# EAGLE design trunetclock_v4 (EAGLE 5.10)
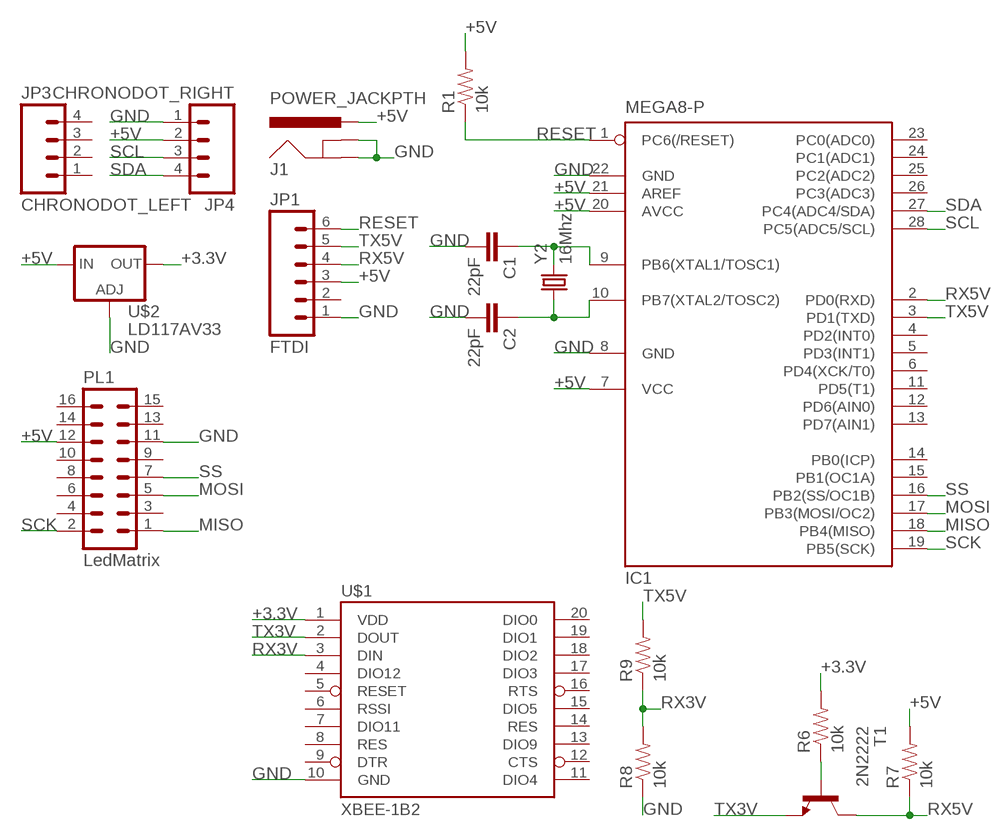
[diagram p0: schematic, sheet 1]

## Parts
C1  22pF  CAPPTH  [CAP-PTH-SMALL]
C2  22pF  CAPPTH  [CAP-PTH-SMALL]
IC1  MEGA8-P  [DIL28-3]
J1  POWER_JACKPTH  [POWER_JACK_PTH]
JP1  FTDI  M06SIP  [1X06]
JP3  CHRONODOT_LEFT  M04PTH  [1X04]
JP4  CHRONODOT_RIGHT  M04PTH  [1X04]
PL1  LedMatrix  16H  [16H]
R1  10k  RESISTORPTH-1/4W  [AXIAL-0.4]
R6  10k  RESISTORPTH-1/4W  [AXIAL-0.4]
R7  10k  RESISTORPTH-1/4W  [AXIAL-0.4]
R8  10k  RESISTORPTH-1/4W  [AXIAL-0.4]
R9  10k  RESISTORPTH-1/4W  [AXIAL-0.4]
T1  2N2222  [TO92-EBC-OVAL]
U$1  XBEE-1B2  [XBEE-SILK]
U$2  LD117AV33  [TO220L1]
Y2  16Mhz  CRYSTALHC49US  [HC49US]

## Nets
+3.3V: R6.P$2 U$1.1(VDD) U$2.2(OUT)
+5V: IC1.7(VCC) IC1.20(AVCC) IC1.21(AREF) J1.PWR JP1.3 JP4.2 PL1.12 R1.P$2 R7.P$2 U$2.3(IN)
GND: C1.2 C2.2 IC1.8(GND) IC1.22(GND) J1.GND J1.GNDBREAK JP1.1 JP4.1 PL1.11 R8.P$1 U$1.10(GND) U$2.1(ADJ)
MISO: IC1.18(PB4(MISO)) PL1.1
MOSI: IC1.17(PB3(MOSI/OC2)) PL1.5
N$4: C2.1 IC1.10(PB7(XTAL2/TOSC2)) Y2.1
N$5: C1.1 IC1.9(PB6(XTAL1/TOSC1)) Y2.2
N$8: R6.P$1 T1.B
RESET: IC1.1(PC6(/RESET)) JP1.6 R1.P$1
RX3V: R8.P$2 R9.P$1 U$1.3(DIN)
RX5V: IC1.2(PD0(RXD)) JP1.4 R7.P$1 T1.C
SCK: IC1.19(PB5(SCK)) PL1.2
SCL: IC1.28(PC5(ADC5/SCL)) JP4.3
SDA: IC1.27(PC4(ADC4/SDA)) JP4.4
SS: IC1.16(PB2(SS/OC1B)) PL1.7
TX3V: T1.E U$1.2(DOUT)
TX5V: IC1.3(PD1(TXD)) JP1.5 R9.P$2
Unconnected: IC1.4(PD2(INT0)) IC1.5(PD3(INT1)) IC1.6(PD4(XCK/T0)) IC1.11(PD5(T1)) IC1.12(PD6(AIN0)) IC1.13(PD7(AIN1)) IC1.14(PB0(ICP)) IC1.15(PB1(OC1A)) IC1.23(PC0(ADC0)) IC1.24(PC1(ADC1)) IC1.25(PC2(ADC2)) IC1.26(PC3(ADC3)) JP1.2 JP3.1 JP3.2 JP3.3 JP3.4 PL1.3 PL1.4 PL1.6 PL1.8 PL1.9 PL1.10 PL1.13 PL1.14 PL1.15 PL1.16 U$1.4(DIO12) U$1.5(RESET) U$1.6(RSSI) U$1.7(DIO11) U$1.8(RES) U$1.9(DTR) U$1.11(DIO4) U$1.12(CTS) U$1.13(DIO9) U$1.14(RES) U$1.15(DIO5) U$1.16(RTS) U$1.17(DIO3) U$1.18(DIO2) U$1.19(DIO1) U$1.20(DIO0)

## Library data of the parts
C1 C2 = SparkFun:CAP: Capacitor Standard 0603 ceramic capacitor, and 0.1" leaded capacitor.
IC1 = atmel:MEGA8-P: MICROCONTROLLER 8 Kbytes FLASH, 1 kbytes SRAM, 512 bytes EEPROM, USART, 4-channel 10 bit ADC, 2-channel 8 bit ADC Pin compatible with Atmega48, ATMega88, ATMega168 Source: avr.lbr; OC_FARNELL: unknown; OC_NEWARK: unknown
J1 = SparkFun:POWER_JACK: Power Jack This is the standard 5.5mm barrel jack for power. The PTH is the most common, proven, reliable, footprint. All others are experimental. The Slot footprint only works if the mill layer is transmitted to the PCB fab house so be warned. Spark Fun Electronics SKU : PRT-00119. Mating wall wart : TOL-00298 (and others)
JP1 = SparkFun:M06: Header 6 Standard 6-pin 0.1" header. Use with straight break away headers (SKU : PRT-00116), right angle break away headers (PRT-00553), swiss pins (PRT-00743), machine pins (PRT-00117), and female headers (PRT-00115). Molex polarized connector foot print use with SKU : PRT-08094 with associated crimp pins and housings. NOTES ON THE VARIANTS LOCK and LOCK_LONGPADS... This footprint was designed to help hold the alignment of a through-hole component (i.e. 6-pin header) while soldering it into place. You may notice that each hole has been shifted either up or down by 0.005 of an inch from it's more standard position (which is a perfectly straight line). This slight alteration caused the pins (the squares in the middle) to touch the edges of the holes. Because they are alternating, it causes a "brace" to hold the component in place. 0.005 has proven to be the perfect amount of "off-center" position when using our standard breakaway headers. Although looks a little odd when you look at the bare footprint, once you have a header in there, the alteration is very hard to notice. Also, if you push a header all the way into place, it is covered up entirely on the bottom side. This idea of altering the position of holes to aid alignment will be further integrated into the Sparkfun Library for other footprints. It can help hold any component with 3 or more connection pins.
JP3 JP4 = SparkFun:M04: Header 4 Standard 4-pin 0.1" header. Use with straight break away headers (SKU : PRT-00116), right angle break away headers (PRT-00553), swiss pins (PRT-00743), machine pins (PRT-00117), and female headers (PRT-00115). Molex polarized connector foot print use with SKU : PRT-08231 with associated crimp pins and housings.
PL1 = con-harting-h:16H: CONNECTOR; OC_FARNELL: unknown; OC_NEWARK: unknown
R1 R6-R9 = SparkFun:RESISTOR: Resistor Basic schematic elements and footprints for 0603, 1206, and PTH resistors.
T1 = adafruit:2N2222: NPN TRANSISTOR Big oval pads
U$1 = SparkFun:XBEE-1
U$2 = v-reg:LD117A?*: Low drop fixed and adjustable positive voltage regulators 1 A Source: http://www.st.com/stonline/products/literature/ds/7194/ld1117axx.pdf
Y2 = SparkFun:CRYSTAL: Crystals Various standard crystals. Proven footprints. Spark Fun Electronics SKU : COM-00534

## Board
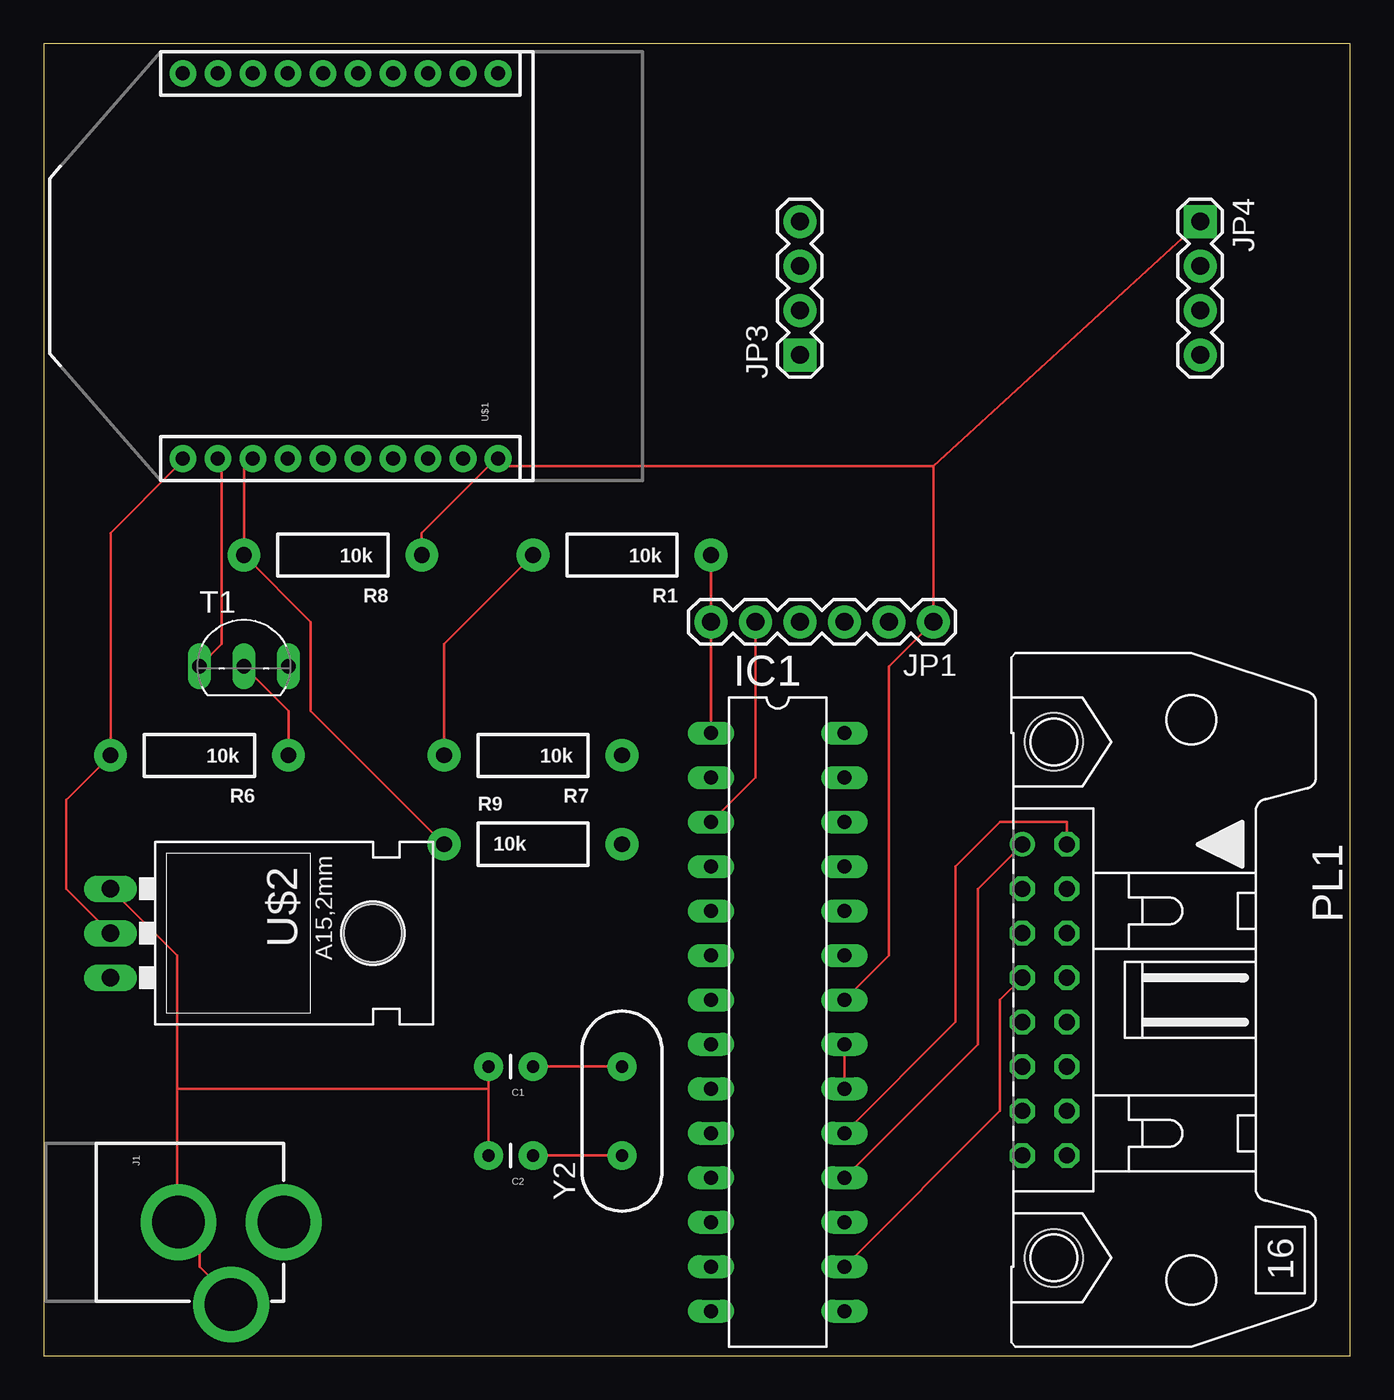
[diagram p1: board, top side]
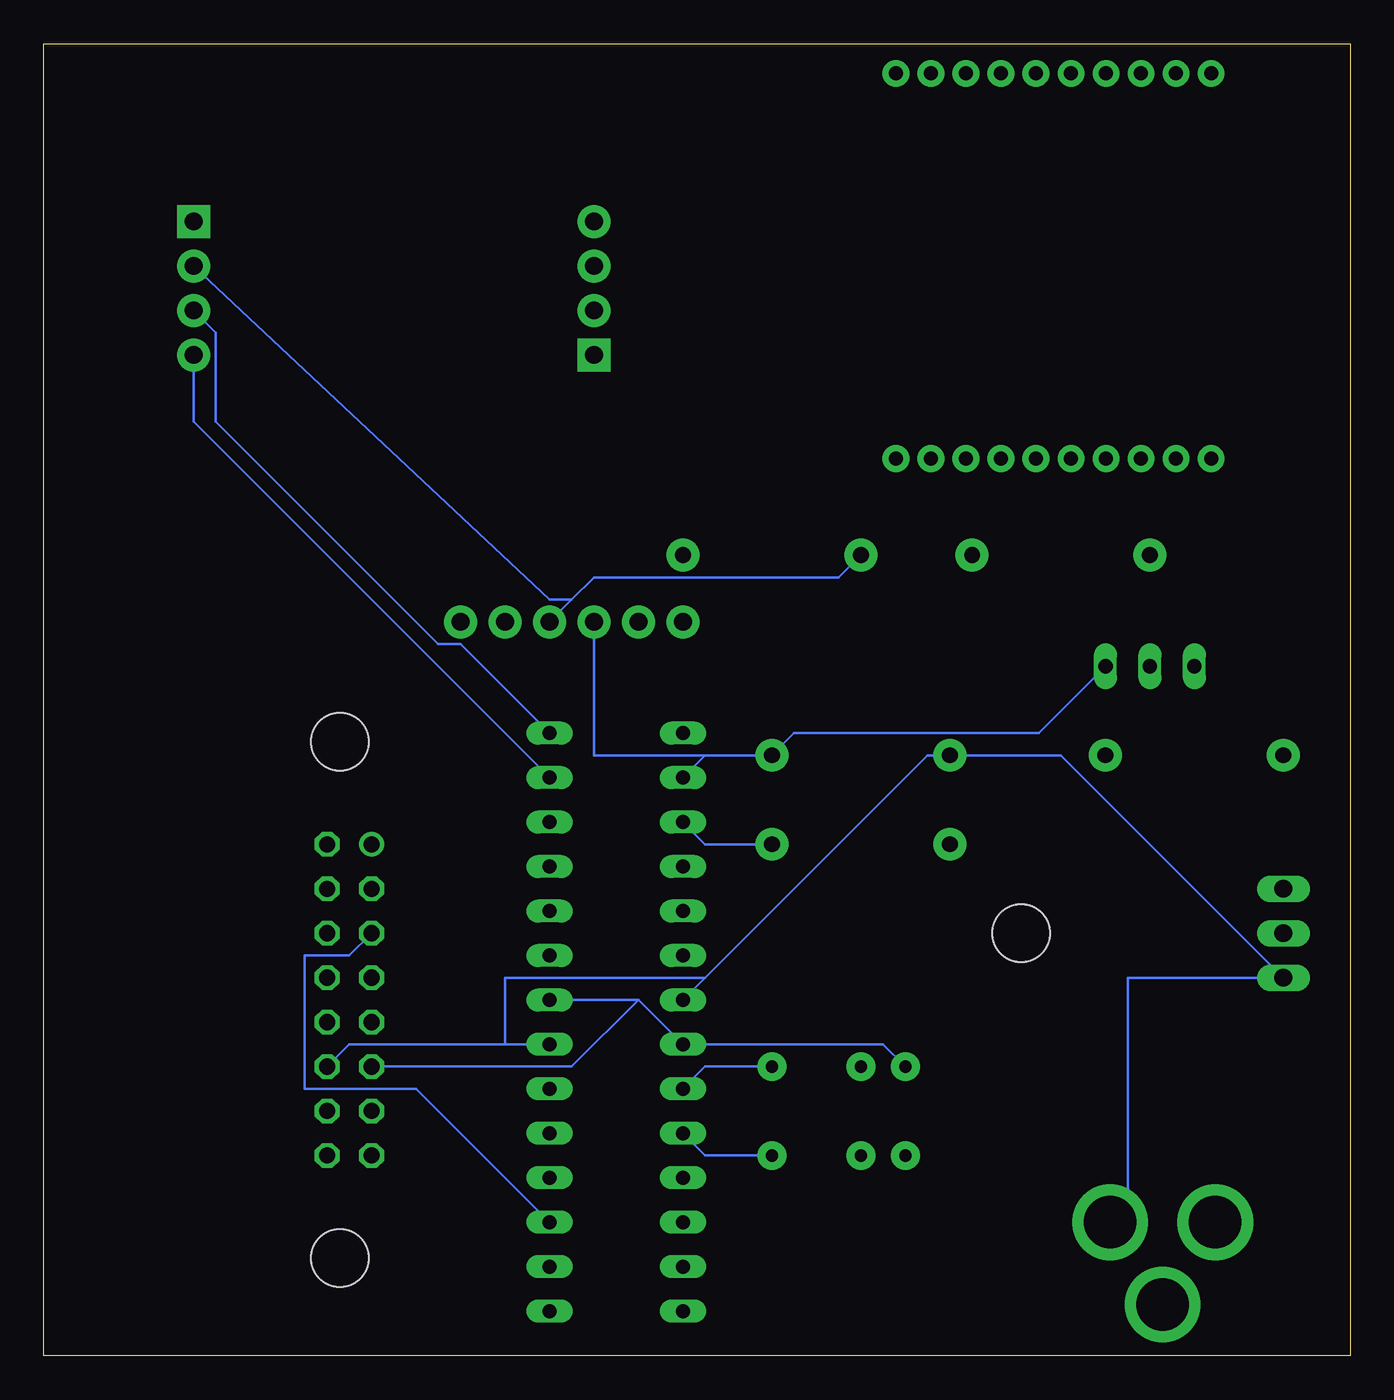
[diagram p2: board, bottom side, seen from below]

Size 74.6 x 74.92 mm. Coordinates in mm from the lower left corner, seen from the top.
Outline: 0,0 74.6,0 74.6,74.92 0,74.92 0,0
Copper layers (1*16): Top 0.035mm / dielectric 1.5mm / Bottom 0.035mm
Design rules "ITead_rule": minimum track width 6mil, minimum drill 12mil, track to track 6mil, track to pad 6mil, pad to pad 6mil, via to via 6mil, smd to smd 0mil, copper to edge 10mil, drill to drill 10mil, minimum pad ring 10mil, minimum via ring 6mil, stop-mask expansion 2mil, vias tented up to drill 100mil, thermal gap 10mil

### Footprints (pad centres in the part's own frame; a part is rotated, then mirrored left to right if it is on the bottom)
CAP-PTH-SMALL = drill 0.7 pad 1.651 round: 1 0,0; 2 2.54,0
DIL28-3 = drill 0.813 long: 1 -16.51,-3.81; 2 -13.97,-3.81; 3 -11.43,-3.81; 4 -8.89,-3.81; 5 -6.35,-3.81; 6 -3.81,-3.81; 7 -1.27,-3.81; 8 1.27,-3.81; 9 3.81,-3.81; 10 6.35,-3.81; 11 8.89,-3.81; 12 11.43,-3.81; 13 13.97,-3.81; 14 16.51,-3.81; 15 16.51,3.81; 16 13.97,3.81; 17 11.43,3.81; 18 8.89,3.81; 19 6.35,3.81; 20 3.81,3.81; 21 1.27,3.81; 22 -1.27,3.81; 23 -3.81,3.81; 24 -6.35,3.81; 25 -8.89,3.81; 26 -11.43,3.81; 27 -13.97,3.81; 28 -16.51,3.81
POWER_JACK_PTH = drill 2.997 pad 4.318 round: GND 0,7.7; GNDBREAK 4.7,10.7; PWR 0,13.7
1X06 = drill 1.016 pad 1.88 round: 1 0,0; 2 2.54,0; 3 5.08,0; 4 7.62,0; 5 10.16,0; 6 12.7,0
1X04 = drill 1.016 pad 1.88 square: 1 0,0 | drill 1.016 pad 1.88 round: 2 2.54,0; 3 5.08,0; 4 7.62,0
16H = drill 0.914 round: 1 -8.89,-1.27 | drill 0.914 octagon: 2 -8.89,1.27; 3 -6.35,-1.27; 4 -6.35,1.27; 5 -3.81,-1.27; 6 -3.81,1.27; 7 -1.27,-1.27; 8 -1.27,1.27; 9 1.27,-1.27; 10 1.27,1.27; 11 3.81,-1.27; 12 3.81,1.27; 13 6.35,-1.27; 14 6.35,1.27; 15 8.89,-1.27; 16 8.89,1.27 | hole 3.302: -14.732,0.533; 14.732,0.533
AXIAL-0.4 = drill 0.9 pad 1.88 round: P$1 -5.08,0; P$2 5.08,0
TO92-EBC-OVAL = drill 0.813 long: B 0,-1.27; C 2.54,-1.27; E -2.54,-1.27
XBEE-SILK = drill 0.8 pad 1.524 round: 1 -11,20; 2 -11,18; 3 -11,16; 4 -11,14; 5 -11,12; 6 -11,10; 7 -11,8; 8 -11,6; 9 -11,4; 10 -11,2; 11 11,2; 12 11,4; 13 11,6; 14 11,8; 15 11,10; 16 11,12; 17 11,14; 18 11,16; 19 11,18; 20 11,20
TO220L1 = drill 1.016 long: 1 -2.54,-3.81; 2 0,-3.81; 3 2.54,-3.81 | hole 3.302: 0,11.176
HC49US = drill 0.7 pad 1.651 round: 1 -2.54,0; 2 2.54,0

### Placement (x,y rotation side)
C1  27.94,16.51 180 top
C2  27.94,11.43 180 top
IC1  41.91,19.05 270 top
J1  0,7.62 270 top
JP1  50.8,41.91 180 top
JP3  43.18,57.15 90 top
JP4  66.04,64.77 270 top
PL1  57.15,20.32 270 top
R1  33.02,45.72 180 top
R6  8.89,34.29 180 top
R7  27.94,34.29 180 top
R8  16.51,45.72 180 top
R9  27.94,29.21 0 top
T1  11.43,40.64 0 top
U$1  27.94,62.23 90 top
U$2  7.62,24.13 270 top
Y2  33.02,13.97 90 top

### Tracks (layer width: path | path; a pad name or v marks a point on that pad's centre or on a via)
+3.3V
  Top 0.152: U$2.2 1.27,26.67 1.27,31.75 R6.P$2 3.81,46.99 7.62,50.8 U$1.1
+5V
  Top 0.152: IC1.21 IC1.20 | R1.P$2 22.86,40.64 R7.P$2
  Bottom 0.152: 44.45,43.18 43.18,44.45 29.21,44.45 R1.P$2 | 44.45,43.18 JP1.3 | JP4.2 45.72,43.18 44.45,43.18 | PL1.12 57.15,17.78 48.26,17.78 | 48.26,17.78 IC1.21 | 36.83,21.59 24.13,34.29 R7.P$2 16.51,34.29 U$2.3 12.7,21.59 12.7,7.62 J1.PWR | 36.83,21.59 IC1.7 | 48.26,17.78 48.26,21.59 36.83,21.59
GND
  Top 0.152: U$2.1 7.62,22.86 7.62,15.24 | 7.62,15.24 7.62,7.62 J1.GND 8.89,7.62 8.89,5.08 10.16,3.81 J1.GNDBREAK | 25.4,50.8 21.59,46.99 R8.P$1 | 25.4,15.24 C1.2 | 25.4,15.24 C2.2 | IC1.22 48.26,22.86 48.26,39.37 JP1.1 50.8,50.8 | 50.8,50.8 JP4.1 | 50.8,50.8 25.4,50.8 | 25.4,50.8 U$1.10 | 7.62,15.24 25.4,15.24
  Bottom 0.152: 40.64,20.32 IC1.8 26.67,17.78 C1.2 | 40.64,20.32 IC1.22 | PL1.11 44.45,16.51 40.64,20.32
MISO
  Top 0.152: IC1.18 53.34,17.78 53.34,26.67 PL1.1
MOSI
  Bottom 0.152: IC1.17 53.34,15.24 59.69,15.24 59.69,22.86 57.15,22.86 PL1.5
N$4
  Top 0.152: C2.1 Y2.1
  Bottom 0.152: IC1.10 36.83,11.43 Y2.1
N$5
  Top 0.152: C1.1 Y2.2
  Bottom 0.152: IC1.9 36.83,16.51 Y2.2
N$8
  Top 0.152: T1.B 13.97,36.83 R6.P$1
RESET
  Top 0.152: IC1.1 JP1.6 R1.P$1
RX3V
  Top 0.152: U$1.3 11.43,50.8 R8.P$2 15.24,41.91 15.24,36.83 R9.P$1
RX5V
  Bottom 0.152: T1.C 17.78,35.56 31.75,35.56 R7.P$1 36.83,34.29 | 36.83,34.29 IC1.2 | JP1.4 43.18,34.29 36.83,34.29
SCK
  Top 0.152: IC1.19 52.07,19.05 52.07,27.94 54.61,30.48 58.42,30.48 PL1.2
SCL
  Bottom 0.152: IC1.28 50.8,40.64 52.07,40.64 64.77,53.34 64.77,58.42 JP4.3
SDA
  Bottom 0.152: IC1.27 66.04,53.34 JP4.4
SS
  Top 0.152: IC1.16 54.61,13.97 54.61,20.32 PL1.7
TX3V
  Top 0.152: T1.E 10.16,40.64 10.16,50.8 U$1.2
TX5V
  Top 0.152: JP1.5 40.64,33.02 IC1.3
  Bottom 0.152: IC1.3 36.83,29.21 R9.P$2